# EasyEDA Pro project scribe.epro

# Schematic SmartPen
Board Name: SmartPen; Create Date: 2025-02-08; Page Name: Sheet_1; Project Name: SCRIBE; Schematic Name: SmartPen; Update Date: 2025-02-08; Add into BOM: yes; Company: Chmelnik industries; Convert to PCB: yes; Date: 2024-11-10; Draw By: AtemiS; REV: 1.0; Sheet: 1/1
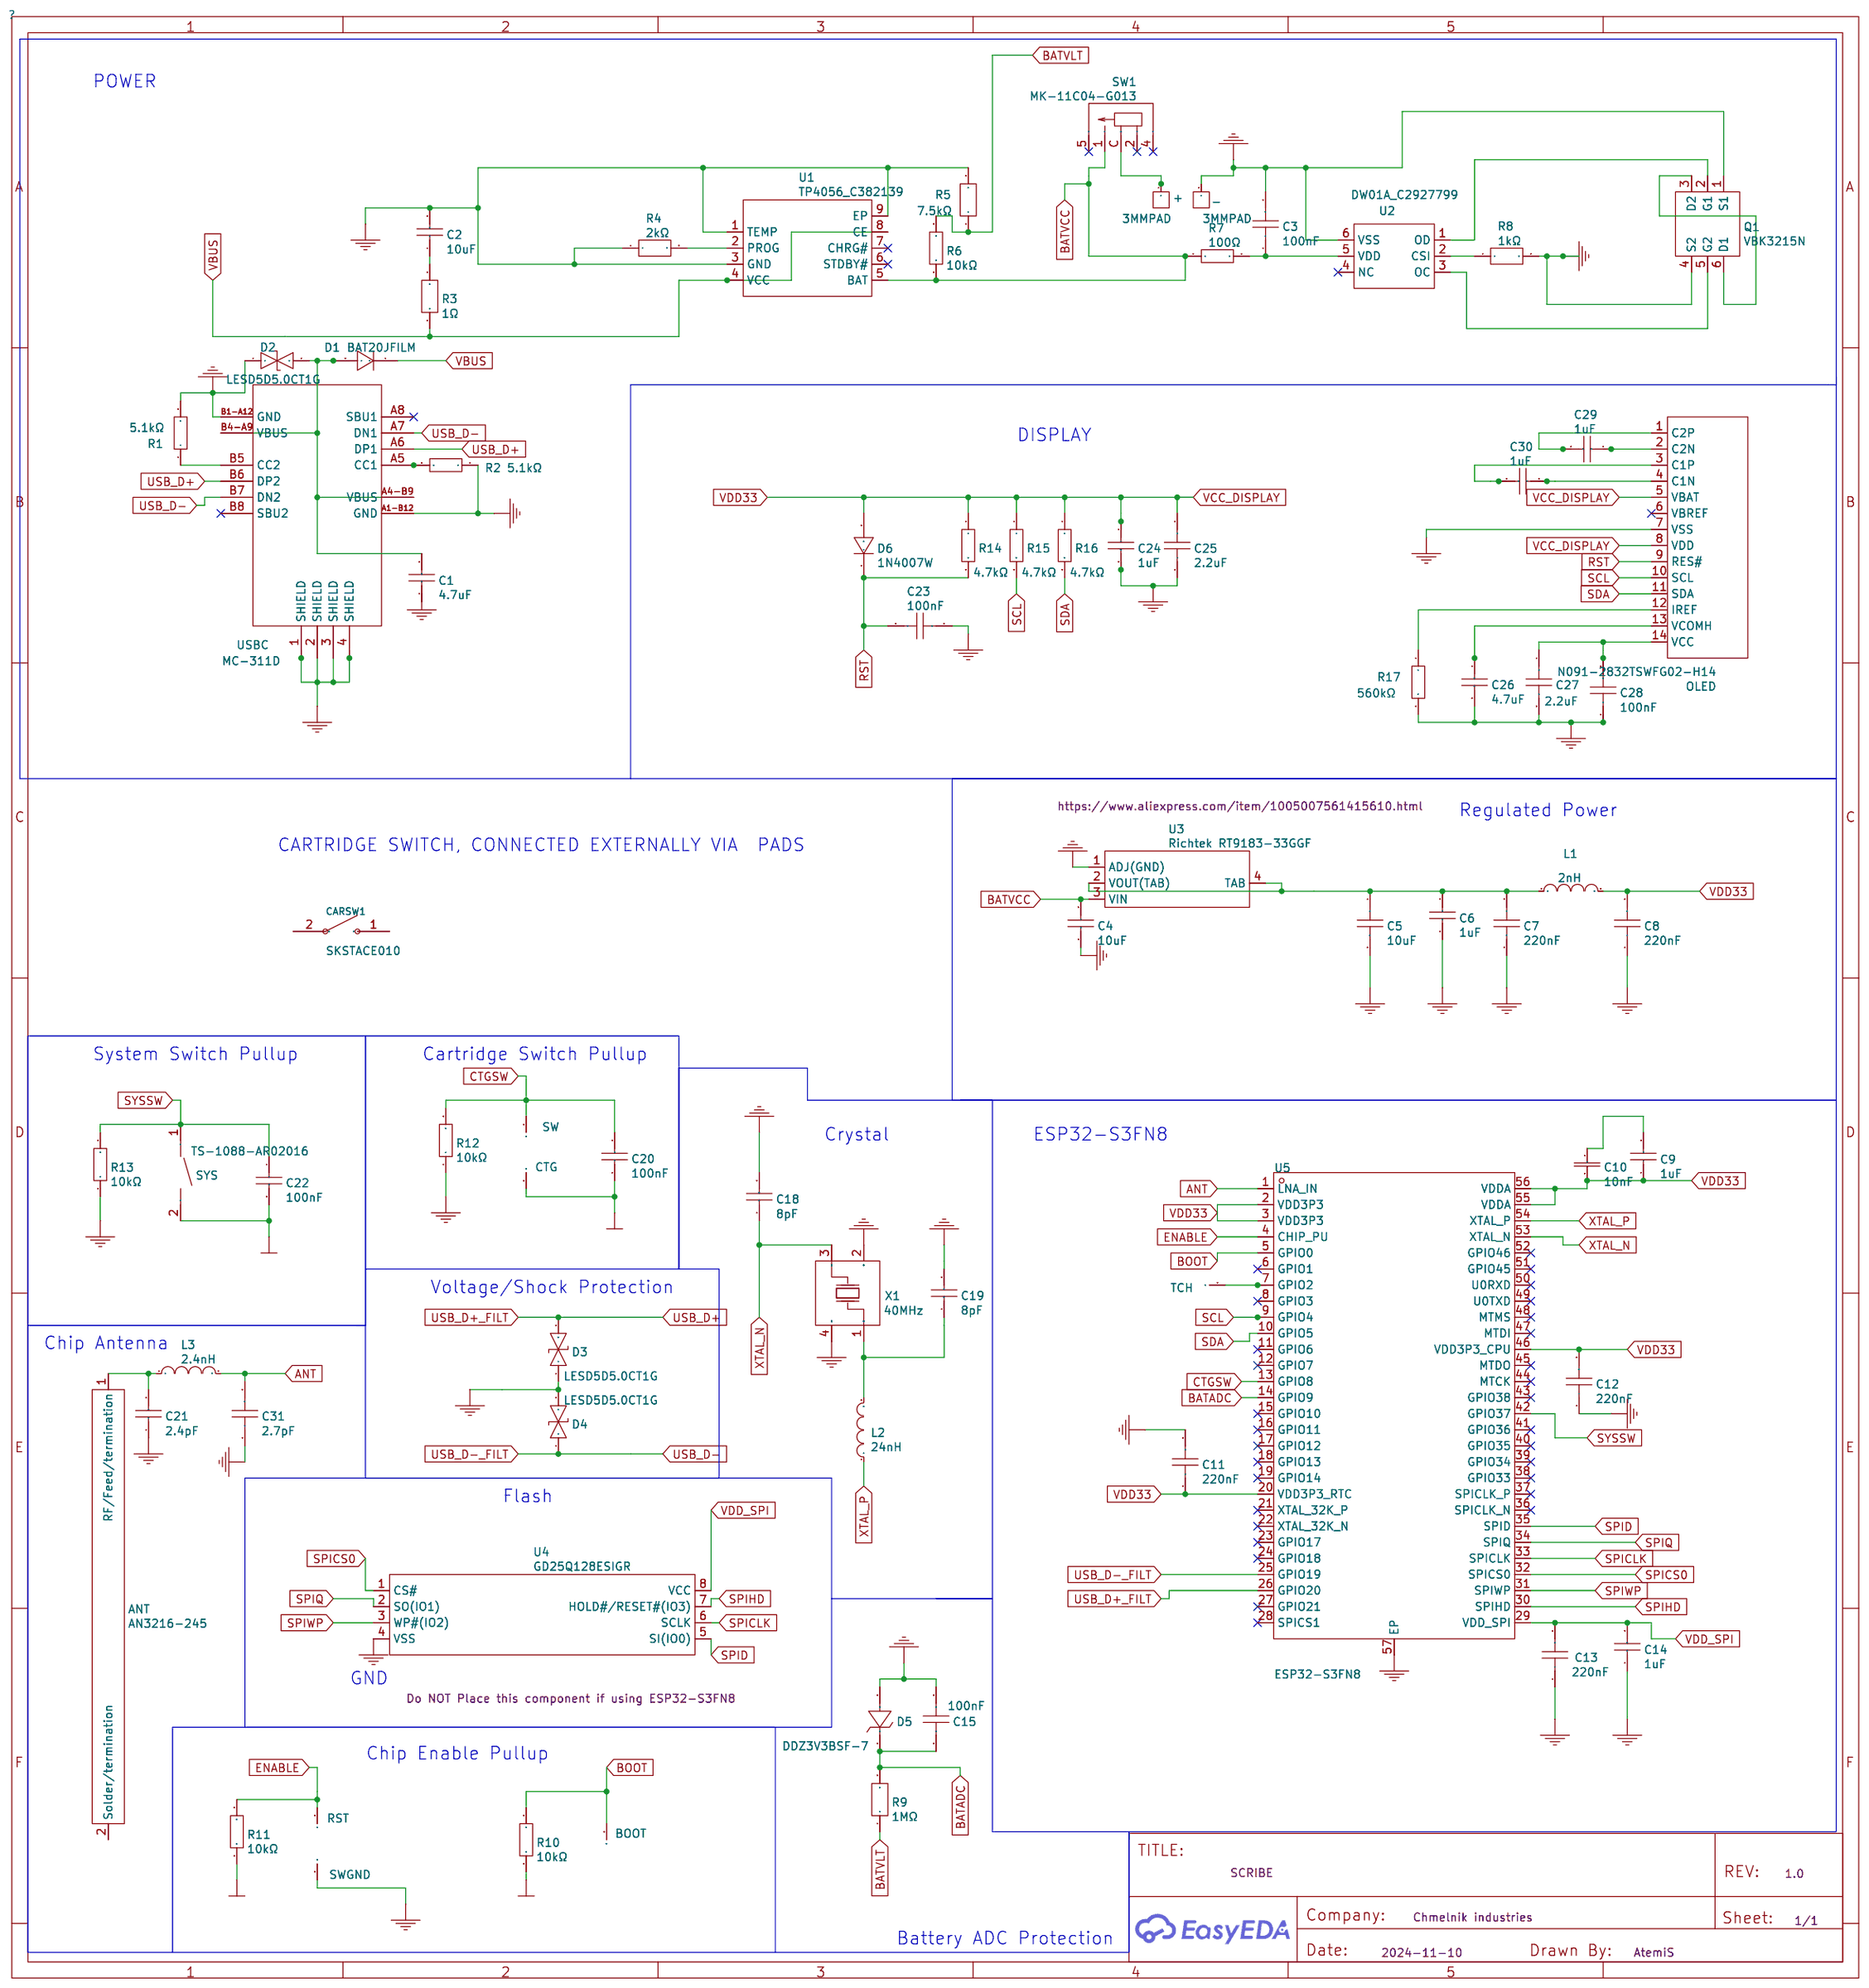
[diagram p0: schematic sheet]

## Parts
+  3MMPAD  [3MMPAD]  (no BOM)
_  3MMPAD  [3MMPAD]  (no BOM)
ANT  AN3216-245  [ANT-SMD_L3.2-W1.6-A]
BOOT  PAD_TERMINAL-32MIL_ROUND  [CON_PAD_ROUND_32MIL]  (no BOM)
C1  4.7uF  [C0805]
C2  10uF  [C0402]
C3  100nF  [C0603]
C4  10uF  [C0402]
C5  10uF  [C0603]
C6  1uF  [C0402]
C7  220nF  [C0402]
C8  220nF  [C0402]
C9  1uF  [C0402]
C10  10nF  [C0201]
C11  220nF  [C0402]
C12  220nF  [C0402]
C13  220nF  [C0402]
C14  1uF  [C0402]
C15  100nF  [C0603]
C18  8pF  [C0402]
C19  8pF  [C0402]
C20  100nF  [C0402]
C21  2.4pF  [C0402]
C22  100nF  [C0402]
C23  100nF  [C0603]
C24  1uF  [C0402]
C25  2.2uF  [C0603]
C26  4.7uF  [C0805]
C27  2.2uF  [C0603]
C28  100nF  [C0603]
C29  1uF  [C0402]
C30  1uF  [C0402]
C31  2.7pF  [C0402]
CARSW1  SKSTACE010  [SW-SMD_L8.5-W8.5-LS8.6]
CTG  PAD_TERMINAL-32MIL_ROUND  [CON_PAD_ROUND_32MIL]  (no BOM)
D1  BAT20JFILM  [SOD-323_L1.8-W1.3-LS2.5-RD]
D2  LESD5D5.0CT1G  [SOD-523_L1.2-W0.8-LS1.6-BI]
D3  LESD5D5.0CT1G  [SOD-523_L1.2-W0.8-LS1.6-BI]
D4  LESD5D5.0CT1G  [SOD-523_L1.2-W0.8-LS1.6-BI]
D5  DDZ3V3BSF-7  [SOD-323F_L1.7-W1.3-LS2.5-RD]
D6  1N4007W  [SOD-123_L2.8-W1.8-LS3.7-RD]
L1  2nH  [L0402-RD]
L2  24nH  [IND-SMD_L1.2-W0.6]
L3  2.4nH  [L0402]
OLED  N091-2832TSWFG02-H14  [OLED-SMD_N091-2832TSWFG02-H14]
Q1  VBK3215N  [SC-70-6_L2.2-W1.3-P0.65-LS2.1-BR]
R1  5.1kΩ  [R0603]
R2  5.1kΩ  [R0603]
R3  1Ω  [R1206]
R4  2kΩ  [RES-SMD_L3.5-W1.5]
R5  7.5kΩ  [R1206]
R6  10kΩ  [R1206]
R7  100Ω  [R1206]
R8  1kΩ  [R1206]
R9  1MΩ  [R0603]
R10  10kΩ  [R0603]
R11  10kΩ  [R0603]
R12  10kΩ  [R0603]
R13  10kΩ  [R0603]
R14  4.7kΩ  [R0603]
R15  4.7kΩ  [R0603]
R16  4.7kΩ  [R0603]
R17  560kΩ  [R1206]
RST  PAD_TERMINAL-32MIL_ROUND  [CON_PAD_ROUND_32MIL]  (no BOM)
SW  PAD_TERMINAL-32MIL_ROUND  [CON_PAD_ROUND_32MIL]  (no BOM)
SW1  MK-11C04-G013  [SW-SMD_MK-11C04-G013]
SWGND  PAD_TERMINAL-32MIL_ROUND  [CON_PAD_ROUND_32MIL]  (no BOM)
SYS  TS-1088-AR02016  [SW-SMD_L3.9-W3.0-P4.45]
TCH  PAD_TERMINAL-32MIL_ROUND  [CON_PAD_ROUND_32MIL]  (no BOM)
U1  TP4056_C382139  [ESOP-8_L4.9-W3.9-P1.27-LS6.0-BL-EP]
U2  DW01A_C2927799  [SOT-23-6_L2.9-W1.6-P0.95-LS2.8-BL]
U3  Richtek RT9183-33GGF  [SOT-223-4_L6.5-W3.5-P2.30-LS7.0-BR]
U4  GD25Q128ESIGR  [SOP-8_L5.3-W5.3-P1.27-LS8.0-BL]
U5  ESP32-S3FN8  [QFN-56_L7.0-W7.0-P0.40-TL-EP4.0]
USBC  MC-311D  [USB-C-SMD_MC-311D]
X1  40MHz  [CRYSTAL-SMD_4P-L2.5-W2.0-BL]

## Library data of the parts
+ _ = 3MMPAD
ANT = AN3216-245: Supplier: LCSC; Supplier Part: C2916136; Manufacturer: rainsun(霖昱微); JLCPCB Part Class: Extended Part
BOOT CTG RST SW SWGND TCH = PAD_TERMINAL-32MIL_ROUND
C1 C26 = 4.7uF: Supplier: LCSC; Manufacturer Part: CL21A475KAQNNNE; Manufacturer: SAMSUNG(三星); Supplier Part: C1779; JLCPCB Part Class: Basic Part
C2 C4 = 10uF: Supplier: LCSC; Manufacturer Part: CL05A106MQ5NUNC; Manufacturer: SAMSUNG(三星); Supplier Part: C15525; JLCPCB Part Class: Basic Part
C3 C15 C23 C28 = 100nF: Supplier: LCSC; Manufacturer: YAGEO(国巨); Manufacturer Part: CC0603KRX7R9BB104; Supplier Part: C14663; JLCPCB Part Class: Basic Part
C5 = 10uF: Supplier: LCSC; Manufacturer: SAMSUNG(三星); Manufacturer Part: CL10A106KP8NNNC; Supplier Part: C19702; JLCPCB Part Class: Basic Part
C6 C9 C14 C24 C29 C30 = 1uF: Supplier: LCSC; Manufacturer Part: GRM155R61C105KA12D; Manufacturer: muRata(村田); Supplier Part: C77006; JLCPCB Part Class: Extended Part
C7 C8 C11-C13 = 220nF: Supplier: LCSC; Supplier Part: C475248; Manufacturer: SANYEAR(叁叶源); Manufacturer Part: C0402X7R224K160NT; JLCPCB Part Class: Extended Part
C10 = 10nF: Supplier: LCSC; Supplier Part: C258479; Manufacturer: DARFON(达方); Manufacturer Part: C0603X5R103KDT; JLCPCB Part Class: Extended Part
C18 C19 = 8pF: Supplier: LCSC; Manufacturer: FH(风华); Manufacturer Part: 0402CG8R0C500NT; Supplier Part: C1578; JLCPCB Part Class: Extended Part
C20 C22 = 100nF: Supplier: LCSC; Manufacturer Part: CL05B104KO5NNNC; Manufacturer: SAMSUNG(三星); Supplier Part: C1525; JLCPCB Part Class: Basic Part
C21 = 2.4pF: Supplier: LCSC; Manufacturer: FH(风华); Manufacturer Part: 0402CG2R4C500NT; Supplier Part: C48346; JLCPCB Part Class: Extended Part
C25 C27 = 2.2uF: Supplier: LCSC; Supplier Part: C599715; Manufacturer: KEMET(基美); Manufacturer Part: C0603C225K8RAC7867; JLCPCB Part Class: Extended Part; link: https://lcsc.com/eda_search?q=C599715&amp;%26type=1&amp;ref=editor
C31 = 2.7pF: Supplier: LCSC; Supplier Part: C326937; Manufacturer: YAGEO(国巨); Manufacturer Part: CC0402BRNPO9BN2R7; JLCPCB Part Class: Extended Part
CARSW1 = SKSTACE010: Circuit:SPST Actuator Style:Round Button Mounting Style:Brick nogging Switch Length:8.5mm Switch Width:8.5mm Switch Height:3.95mm Contact Current:50mA Voltage Rating (DC):16V With Lamp:- Mechanical Life:-; LCSC Part Name: 8.5*8.5*3.95mm 立贴 轻触开关; Supplier Part: C341731; Manufacturer: ALPSALPINE(阿尔卑斯阿尔派); Supplier Footprint: SMD; JLCPCB Part Class: Extended Part; Datasheet: https://atta.szlcsc.com/upload/public/pdf/source/20181207/C341731_83631AC416A995A22756F96AE3924A85.pdf; Supplier: LCSC; Circuit: SPST; Actuator Style: Round Button; Mounting Style: Brick nogging; Switch Length: 8.5mm; Switch Width: 8.5mm; Switch Height: 3.95mm; Contact Current: 50mA; Voltage Rating (DC): 16V
D1 = BAT20JFILM: Supplier Part: C155590; Supplier: LCSC; Manufacturer: ST(意法半导体); JLCPCB Part Class: Extended Part
D2-D4 = LESD5D5.0CT1G: Supplier: LCSC; Supplier Part: C383211; Manufacturer: LRC(乐山无线电); JLCPCB Part Class: Extended Part
D5 = DDZ3V3BSF-7: Supplier: LCSC; Supplier Part: C156333; Manufacturer: DIODES(美台); JLCPCB Part Class: Extended Part
D6 = 1N4007W: Supplier: LCSC; Supplier Part: C328592; Manufacturer: BLUE ROCKET
L1 = 2nH: Supplier: LCSC; Supplier Part: C404617; Manufacturer: TDK; Manufacturer Part: MLG1005S2N0BTD25; JLCPCB Part Class: Extended Part
L2 = 24nH: Supplier: LCSC; Supplier Part: C370295; Manufacturer: Sunlord(顺络); Manufacturer Part: SDWL1005C24NJSTF; JLCPCB Part Class: Extended Part
L3 = 2.4nH: Supplier: LCSC; Manufacturer: muRata(村田); Manufacturer Part: LQG15HS2N4S02D; Supplier Part: C97997; JLCPCB Part Class: Extended Part; link: https://lcsc.com/eda_search?q=C97997&amp;%26type=1&amp;ref=editor
OLED = N091-2832TSWFG02-H14: Supplier: LCSC; Supplier Part: C2890599; Manufacturer: Newvision(新智景); JLCPCB Part Class: Extended Part
Q1 = VBK3215N: Supplier: LCSC; Supplier Part: C516947; Manufacturer: VBsemi(微碧半导体); JLCPCB Part Class: Extended Part
R1 R2 = 5.1kΩ: Supplier: LCSC; Manufacturer Part: 0603WAF5101T5E; Manufacturer: UNI-ROYAL(厚声); Supplier Part: C23186; JLCPCB Part Class: Basic Part
R3 = 1Ω: Supplier: LCSC; Supplier Part: C513714; Manufacturer: YAGEO(国巨); Manufacturer Part: RT1206BRD071RL; JLCPCB Part Class: Extended Part
R4 = 2kΩ: Supplier: LCSC; Supplier Part: C410713; Manufacturer: Tyohm(幸亚电阻); Manufacturer Part: RJM74P0204F2T2001; JLCPCB Part Class: Extended Part
R5 = 7.5kΩ: Supplier: LCSC; Supplier Part: C870892; Manufacturer: YAGEO(国巨); Manufacturer Part: RT1206BRD077K5L; JLCPCB Part Class: Extended Part
R6 = 10kΩ: Supplier: LCSC; Manufacturer: YAGEO(国巨); Manufacturer Part: RT1206BRD0710KL; Supplier Part: C136889; JLCPCB Part Class: Extended Part
R7 = 100Ω: Supplier: LCSC; Supplier Part: C728670; Manufacturer: YAGEO(国巨); Manufacturer Part: RT1206BRD07100RL; JLCPCB Part Class: Extended Part
R8 = 1kΩ: Supplier: LCSC; Supplier Part: C706405; Manufacturer: YAGEO(国巨); Manufacturer Part: RT1206BRD071KL; JLCPCB Part Class: Extended Part
R9 = 1MΩ: Supplier: LCSC; Supplier Part: C427290; Manufacturer: PANASONIC(松下); Manufacturer Part: ERJP03J105V; JLCPCB Part Class: Extended Part
R10-R13 = 10kΩ: Supplier: LCSC; Manufacturer: UNI-ROYAL(厚声); Manufacturer Part: 0603WAF1002T5E; Supplier Part: C25804; JLCPCB Part Class: Basic Part
R14-R16 = 4.7kΩ: Supplier: LCSC; Supplier Part: C309085; Manufacturer: Viking(光颉); Manufacturer Part: ARG03BTC4701; JLCPCB Part Class: Extended Part
R17 = 560kΩ: Supplier: LCSC; Manufacturer: YAGEO(国巨); Manufacturer Part: RC1206FR-07560KL; Supplier Part: C137254; JLCPCB Part Class: Extended Part; link: https://lcsc.com/eda_search?q=C137254&amp;%26type=1&amp;ref=editor
SW1 = MK-11C04-G013: Supplier: LCSC; Supplier Part: C778185; Manufacturer: G-Switch(品赞); JLCPCB Part Class: Extended Part
SYS = TS-1088-AR02016: Supplier: LCSC; Supplier Part: C720477; Manufacturer: XUNPU(讯普); JLCPCB Part Class: Extended Part
U1 = TP4056_C382139: Supplier: LCSC; Supplier Part: C382139; Manufacturer: TPOWER(天源); Manufacturer Part: TP4056; JLCPCB Part Class: Extended Part
U2 = DW01A_C2927799: Supplier: LCSC; Supplier Part: C2927799; Manufacturer: YONGYUTAI(永裕泰); Manufacturer Part: DW01A; JLCPCB Part Class: Extended Part
U3 = AMS1117-3.3_C347222: You need to source this yoursef. LCSC doesnt have it; Supplier: Aliexpress; Supplier Part: https://www.aliexpress.com/item/1005007561415610.html; Manufacturer: Richtek; Manufacturer Part: RT9183-33GGF; JLCPCB Part Class: Extended Part; Link: https://www.aliexpress.com/item/1005007561415610.html
U4 = GD25Q128ESIGR: Do NOT Place this component if using ESP32-S3FN8; Supplier: LCSC; Supplier Part: C2928891; Manufacturer: GigaDevice(兆易创新); JLCPCB Part Class: Extended Part
U5 = ESP32-S3FN8: Supplier Part: C2913196; Manufacturer: ESPRESSIF(乐鑫); Supplier Footprint: QFN-56-EP(7x7); JLCPCB Part Class: Extended Part; Datasheet: https://atta.szlcsc.com/upload/public/pdf/source/20241030/3428D9BCA56E860957850BFAF37EAC62.pdf; Supplier: LCSC
USBC = MC-311D: Supplier: LCSC; Supplier Part: C136423; Manufacturer: SOFNG(硕方); JLCPCB Part Class: Extended Part
X1 = 40MHz: Supplier: LCSC; Supplier Part: C409424; Manufacturer: KYX(凯越翔); Manufacturer Part: K2C400000910; JLCPCB Part Class: Extended Part

## Nets
GND: _.1 C1.1 C2.2 C3.2 C4.1 C5.2 C6.1 C7.1 C8.1 C11.2 C12.1 C13.1 C14.1 C15.2 C18.2 C19.2 C21.1 C23.1 C24.2 C25.2 C26.2 C27.2 C28.1 C31.1 D2.1 D3.1 D4.2 D5.2(A) OLED.7(VSS) Q1.1(S1) Q1.4(S2) R1.2 R2.1 R4.1 R5.2 R8.2 R12.1 R13.1 R17.2 SWGND.P U1.1(TEMP) U1.3(GND) U1.9(EP) U2.6(VSS) U3.1(ADJ(GND)) U4.4(VSS) U5.57(EP) USBC.1(SHIELD) USBC.2(SHIELD) USBC.3(SHIELD) USBC.4(SHIELD) USBC.A1-B12(GND) USBC.B1-A12(GND) X1.2(GND) X1.4(GND)
VBUS: D1.1(K) R3.2 U1.4(VCC) U1.8(CE)
VDD33: C8.2 C9.1 C10.2 C11.1 C12.2 C20.2 C22.2 C24.1 C25.1 CTG.P D6.2 L1.2 OLED.5(VBAT) OLED.8(VDD) R10.1 R11.1 R14.1 R15.1 R16.1 SYS.2 U5.2(VDD3P3) U5.3(VDD3P3) U5.20(VDD3P3_RTC) U5.46(VDD3P3_CPU) U5.55(VDDA) U5.56(VDDA)
VDD_SPI: C13.2 C14.2 U4.8(VCC) U5.29(VDD_SPI)
ANT: C31.2 L3.2 U5.1(LNA_IN)
BATADC: C15.1 D5.1(K) R9.2 U5.14(GPIO9)
BATVCC: C4.2 R6.1 R7.1 SW1.1 U1.5(BAT) U3.3(VIN)
BATVLT: R5.1 R6.2 R9.1
BOOT: BOOT.P R10.2 U5.5(GPIO0)
CTGSW: C20.1 R12.2 SW.P U5.13(GPIO8)
ENABLE: R11.2 RST.P U5.4(CHIP_PU)
RST: C23.2 D6.1 OLED.9(RES#) R14.2
SCL: OLED.10(SCL) R15.2 U5.9(GPIO4)
SDA: OLED.11(SDA) R16.2 U5.10(GPIO5)
SPICLK: U4.6(SCLK) U5.33(SPICLK)
SPICS0: U4.1(CS#) U5.32(SPICS0)
SPID: U4.5(SI(IO0)) U5.35(SPID)
SPIHD: U4.7(HOLD#/RESET#(IO3)) U5.30(SPIHD)
SPIQ: U4.2(SO(IO1)) U5.34(SPIQ)
SPIWP: U4.3(WP#(IO2)) U5.31(SPIWP)
SYSSW: C22.1 R13.2 SYS.1 U5.42(GPIO37)
USB_D+: D3.2 U5.26(GPIO20) USBC.A6(DP1) USBC.B6(DP2)
USB_D-: D4.1 U5.25(GPIO19) USBC.A7(DN1) USBC.B7(DN2)
XTAL_N: C18.1 U5.53(XTAL_N) X1.3(OSC2)
XTAL_P: L2.1 U5.54(XTAL_P)
ANT_1: ANT.1(RF/Feed/termination) C21.2 L3.1
C1_2: C1.2 D1.2(A) D2.2 USBC.A4-B9(VBUS) USBC.B4-A9(VBUS)
C9_2: C9.2 C10.1
L2_2: C19.1 L2.2 X1.1(OSC1)
Net-(TCH-P): TCH.P U5.7(GPIO2)
OLED_1: C29.2 OLED.1(C2P)
OLED_2: C29.1 OLED.2(C2N)
OLED_3: C30.2 OLED.3(C1P)
OLED_4: C30.1 OLED.4(C1N)
OLED_12: OLED.12(IREF) R17.1
OLED_13: C26.1 OLED.13(VCOMH)
OLED_14: C27.1 C28.2 OLED.14(VCC)
Q1_6: Q1.3(D2) Q1.6(D1)
R3_1: C2.1 R3.1
SW1_C: +.1 SW1.C
U1_2: R4.2 U1.2(PROG)
U2_1: Q1.2(G1) U2.1(OD)
U2_2: R8.1 U2.2(CSI)
U2_3: Q1.5(G2) U2.3(OC)
U2_5: C3.1 R7.2 U2.5(VDD)
U3_2: C5.1 C6.2 C7.2 L1.1 U3.2(VOUT(TAB)) U3.4(TAB)
USBC_A5: R2.2 USBC.A5(CC1)
USBC_B5: R1.1 USBC.B5(CC2)

Not connected (* = marked no-connect by the designer): ANT 2(Solder/termination); CARSW1 1 2; OLED 6(VBREF)*; SW1 2* 4* 5*; U1 6(STDBY#)* 7(CHRG#)*; U2 4(NC)*; U5 6(GPIO1)* 8(GPIO3)* 11(GPIO6)* 12(GPIO7)* 15(GPIO10)* 16(GPIO11)* 17(GPIO12)* 18(GPIO13)* 19(GPIO14)* 21(XTAL_32K_P)* 22(XTAL_32K_N)* 23(GPIO17)* 24(GPIO18)* 27(GPIO21)* 28(SPICS1)* 36(SPICLK_N)* 37(SPICLK_P)* 38(GPIO33)* 39(GPIO34)* 40(GPIO35)* 41(GPIO36)* 43(GPIO38)* 44(MTCK)* 45(MTDO)* 47(MTDI)* 48(MTMS)* 49(U0TXD)* 50(U0RXD)* 51(GPIO45)* 52(GPIO46)*; USBC A8(SBU1)* B8(SBU2)*

## Notes on the sheet
- POWER
- DISPLAY
- Regulated Power
- CARTRIDGE SWITCH, CONNECTED EXTERNALLY VIA  PADS
- System Switch Pullup
- Cartridge Switch Pullup
- Crystal
- ESP32-S3FN8
- Voltage/Shock Protection
- Chip Antenna
- Flash
- GND
- Chip Enable Pullup
- Battery ADC Protection

# Board PCB_PCB_SmartPen_3_2024-12-07
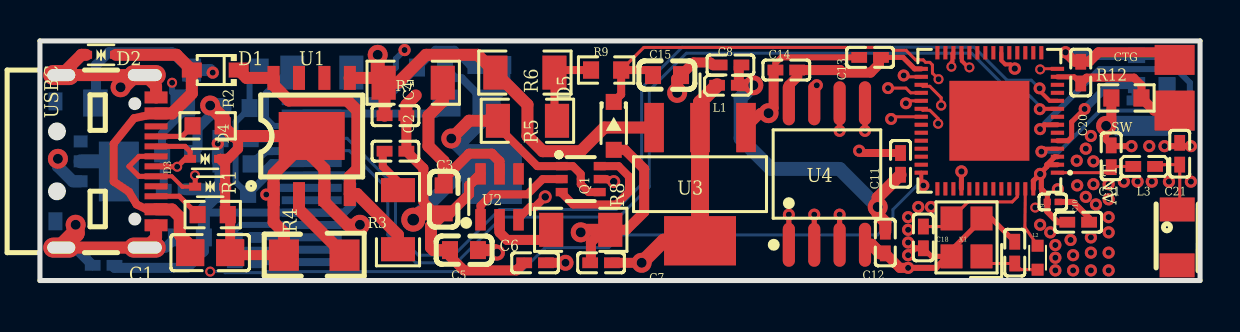
[diagram p1: board, top side]
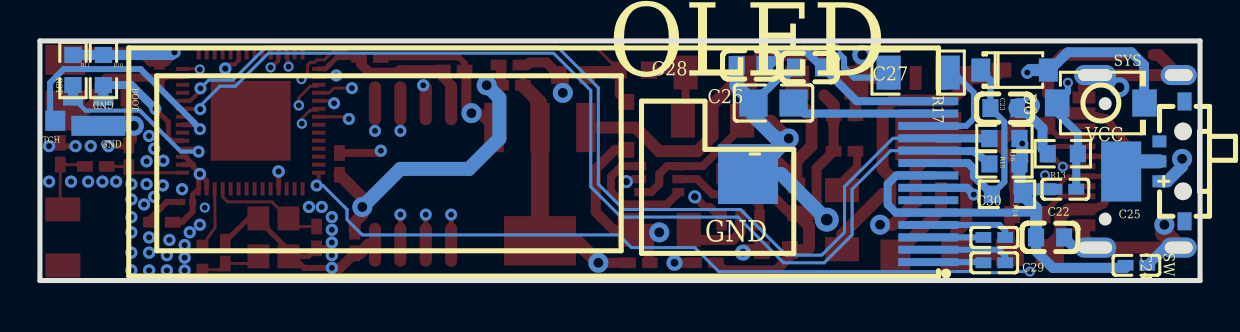
[diagram p2: board, bottom side, seen from below]

Outline 58.05 x 12 mm; copper layers: Top Layer, Inner1, Inner2, Bottom Layer. Coordinates in mm from the lower left corner of the outline.
Outline path: 0,12 58.05,12 58.05,0 0,0 0,12
Stack: Top Layer 0.035mm / Dielectric1 0.48mm PP er 4.5 / Inner1 0.035mm / Dielectric2 0.48mm FR4 er 4.5 / Inner2 0.035mm / Dielectric3 0.48mm PP er 4.5 / Bottom Layer 0.035mm

## Design rules (mm)
template: User Custom Config
spacing Default (default): track to track 0.152, other pairs 0 to 0.4
track width Default: min 0.254, default 0.254, max 25.4
track width ESP (default): min 0.15, default 0.15, max 25.4
track width VBUS: min 1.999, default 1.999, max 25.4
differential pair differentialPair (default): width min 0.127, default 0.254, max 2.54; gap min 0.152, default 0.152
via Default: diameter min 0.61, default 0.61, max 100.025; hole min 0.305, default 0.305, max 59.995
via ESP (default): diameter min 0.399, default 0.399, max 100.025; hole min 0.201, default 0.201, max 59.995
via VBUS: diameter min 0.8, default 0.8, max 100.025; hole min 0.399, default 0.399, max 59.995
net GND uses ESP, copperRegion1
net SPIWP uses ESP
net SPIQ uses ESP
net SPICS0 uses ESP
net SPID uses ESP
net SPICLK uses ESP
net SPIHD uses ESP
net ENABLE uses ESP
net BOOT uses ESP
net SCL uses ESP
net SDA uses ESP
net SYSSW uses ESP
net BATADC uses ESP
net XTAL_P uses ESP
net ANT uses ESP
net XTAL_N uses ESP
net RST uses ESP
net ESP_7 uses ESP
net USB_D-_FILT uses ESP
net USB_D+_FILT uses ESP
net L2_2 uses ESP
net OLED_12 uses ESP
net OLED_2 uses ESP
net OLED_3 uses ESP
net OLED_4 uses ESP
net OLED_13 uses ESP
net OLED_14 uses ESP
net OLED_1 uses ESP
net ANT_1 uses ESP
net ANT_2 uses ESP
pour e1468 uses Default

## Placement (name value [footprint] x y rotation side)
+  -  [3MMPAD#2]  3.95 5.46 270 bottom
_  -  [3MMPAD]  22.61 5.33 180 bottom
ANT  AN3216-245  [ANT-SMD_L3.2-W1.6-A]  56.9 2.16 270 top
BOOT  PAD_TERMINAL-32MIL_ROUND  [CON_PAD_ROUND_32MIL#3]  54.87 9.02 180 bottom
C1  4.7uF  [C0805]  8.52 1.4 180 top
C2  10uF  [C0402]  17.79 6.48 0 top
C3  100nF  [C0603]  20.2 4.06 270 top
C4  10uF  [C0402]  17.79 8.25 180 top
C5  10uF  [C0603]  21.22 1.52 180 top
C6  1uF  [C0402]  24.77 0.89 0 top
C7  220nF  [C0402]  28.08 0.89 0 top
C8  220nF  [C0402]  34.55 10.79 0 top
C9  1uF  [C0402]  51.95 2.92 0 top
C10  10nF  [C0201]  50.68 3.94 180 top
C11  220nF  [C0402]  43.06 5.84 90 top
C12  220nF  [C0402]  42.3 1.9 90 top
C13  220nF  [C0402]  41.54 11.18 0 top
C14  1uF  [C0402]  37.35 10.54 0 top
C15  100nF  [C0603]  31.38 10.29 0 top
C18  8pF  [C0402]  44.2 2.16 270 top
C19  8pF  [C0402]  48.78 1.4 90 top
C20  100nF  [C0402]  52.08 10.41 90 top
C21  2.4pF  [C0402]  57.03 6.35 270 top
C22  100nF  [C0402]  6.74 4.57 0 bottom
C23  100nF  [C0603]  9.79 8.64 0 bottom
C24  1uF  [C0402]  3.18 0.76 180 bottom
C25  2.2uF  [C0603]  7.5 2.16 180 bottom
C26  4.7uF  [C0805]  21.34 8.89 0 bottom
C27  2.2uF  [C0603]  19.57 10.67 0 bottom
C28  100nF  [C0603]  22.49 10.79 180 bottom
C29  1uF  [C0402]  10.3 0.89 0 bottom
C30  1uF  [C0402]  10.3 2.16 0 bottom
C31  2.7pF  [C0402]  53.6 6.22 270 top
CTG  PAD_TERMINAL-32MIL_ROUND  [CON_PAD_ROUND_32MIL#2]  56.78 11.05 0 top
D1  BAT20JFILM  [SOD-323_L1.8-W1.3-LS2.5-RD]  8.77 10.54 180 top
D2  LESD5D5.0CT1G  [SOD-523_L1.2-W0.8-LS1.6-BI]  3.06 11.3 0 top
D3  LESD5D5.0CT1G  [SOD-523_L1.2-W0.8-LS1.6-BI]  8.52 4.7 180 top
D4  LESD5D5.0CT1G  [SOD-523_L1.2-W0.8-LS1.6-BI]  8.26 6.1 0 top
D5  DDZ3V3BSF-7  [SOD-323F_L1.7-W1.3-LS2.5-RD]  28.71 7.75 270 top
D6  1N4007W  [SOD-123_L2.8-W1.8-LS3.7-RD]  9.28 10.54 180 bottom
ESP  ESP32-S3  [QFN-56_L7.0-W7.0-P0.40-TL-EP4.0]  47.51 8 180 top
L1  2nH  [L0402-RD]  34.42 9.78 0 top
L2  24nH  [IND-SMD_L1.2-W0.6]  49.92 1.14 270 top
L3  2.4nH  [L0402]  55.25 5.71 180 top
NOREF  -  [Pad_e169]  55.13 7.75 90 top
OLED  N091-2832TSWFG02-H14  [OLED-SMD_N091-2832TSWFG02-H14]  13.6 4.95 180 bottom
Q1  VBK3215N  [SC-70-6_L2.2-W1.3-P0.65-LS2.1-BR]  27.06 5.08 180 top
R1  5.1kΩ  [R0603]  8.64 3.3 0 top
R2  5.1kΩ  [R0603]  8.39 7.75 180 top
R3  1Ω  [R1206]  17.92 3.05 270 top
R4  2kΩ  [RES-SMD_L3.5-W1.5]  13.72 1.27 0 top
R5  7.5kΩ  [R1206]  24.39 8 180 top
R6  10kΩ  [R1206]  24.27 10.41 0 top
R7  100Ω  [R1206]  18.68 9.91 0 top
R8  1kΩ  [R1206]  27.06 2.54 0 top
R9  1MΩ  [R0603]  28.33 10.54 0 top
R10  10kΩ  [R0603]  54.87 10.54 270 bottom
R11  10kΩ  [R0603]  56.4 10.54 270 bottom
R12  10kΩ  [R0603]  54.36 9.14 0 top
R13  10kΩ  [R0603]  6.87 6.35 180 bottom
R14  4.7kΩ  [R0603]  9.66 4.32 0 bottom
R15  4.7kΩ  [R0603]  9.79 5.84 0 bottom
R16  4.7kΩ  [R0603]  9.79 7.11 0 bottom
R17  560kΩ  [R1206]  14.11 10.41 0 bottom
RST  PAD_TERMINAL-32MIL_ROUND  [CON_PAD_ROUND_32MIL#3]  56.4 9.02 180 bottom
SW  PAD_TERMINAL-32MIL_ROUND  [CON_PAD_ROUND_32MIL]  56.78 8.51 0 top
SW1  MK-11C04-G013  [SW-SMD_MK-11C04-G013]  1.41 5.97 90 bottom
SYS  TS-1088-AR02016  [SW-SMD_L3.9-W3.0-P4.45]  4.96 8.89 180 bottom
TCH  PAD_TERMINAL-32MIL_ROUND  [CON_PAD_ROUND_32MIL#4]  57.29 8 180 bottom
U1  TP4056_C382139  [ESOP-8_L4.9-W3.9-P1.27-LS6.0-BL-EP]  13.6 7.24 0 top
U2  DW01A_C2927799  [SOT-23-6_L2.9-W1.6-P0.95-LS2.8-BL]  23 4.19 0 top
U3  Richtek RT9183-33GGF  [SOT-223-4_L6.5-W3.5-P2.30-LS7.0-BR]  33.03 4.83 90 top
U4  GD25Q128ESIGR  [SOP-8_L5.3-W5.3-P1.27-LS8.0-BL]  39.38 5.33 0 top
USBC  MC-311D  [USB-C-SMD_MC-311D]  3.44 5.97 270 top
X1  40MHz  [CRYSTAL-SMD_4P-L2.5-W2.0-BL]  46.36 2.16 90 top

## Footprints (pads in the part's own frame, mm; a bottom-side part is the same pattern mirrored in y, then rotated)
3MMPAD
  rect 3x3 smd: 1(0.001,-0.001)
3MMPAD#2
  rect 3x2 smd: 1(0.001,-0.001)
ANT-SMD_L3.2-W1.6-A
  rect 1.2x1.75 smd: 1(-1.4,0.004) 2(1.4,-0.004)
C0201
  rect 0.368x0.324 smd: 1(-0.275,0) 2(0.275,0)
C0402
  rect 0.79x0.54 smd: 1(-0.545,0) 2(0.545,0)
C0603
  rect 0.8x0.9 smd: 1(-0.7,0) 2(0.7,0)
C0805
  rect 1.41x1.35 smd: 1(-1,0) 2(1,0)
CON_PAD_ROUND_32MIL
  rect 2x2 smd: P(0,0)
CON_PAD_ROUND_32MIL#2
  rect 2x1.5 smd: P(0,0)
CON_PAD_ROUND_32MIL#3
  rect 1x0.5 smd: P(0,0)
CON_PAD_ROUND_32MIL#4
  rect 1x1 smd: P(0,0)
CRYSTAL-SMD_4P-L2.5-W2.0-BL
  rect 1.2x1.1 smd: 1(-0.95,-0.75) 2(0.95,-0.75) 3(0.95,0.75) 4(-0.95,0.75)
ESOP-8_L4.9-W3.9-P1.27-LS6.0-BL-EP
  rect 0.6x1.2 smd: 1(-1.905,-2.909) 2(-0.635,-2.909) 3(0.635,-2.909) 4(1.905,-2.909) 5(1.905,2.909) 6(0.635,2.909) 7(-0.635,2.909) 8(-1.905,2.909)
  rect 3.3x2.4 smd: 9(0,0)
IND-SMD_L1.2-W0.6
  rect 0.6x0.6 smd: 1(-0.6,0) 2(0.6,0)
L0402
  rect 0.79x0.54 smd: 1(-0.545,0) 2(0.545,0)
L0402-RD
  rect 0.79x0.54 smd: 1(-0.545,0) 2(0.545,0)
OLED-SMD_N091-2832TSWFG02-H14
  rect 3x0.4 smd: 1(0,-4.03) 2(0,-3.41) 3(0,-2.79) 4(0,-2.17) 5(0,-1.55) 6(0,-0.93) 7(0,-0.31) 8(0,0.31) 9(0,0.93) 10(0,1.55) 11(0,2.17) 12(0,2.79) 13(0,3.41) 14(0,4.03)
Pad_e169
  rect 1x2.7 smd far side: 1(0,0)
QFN-56_L7.0-W7.0-P0.40-TL-EP4.0
  rect 0.665x0.2 smd: 1(-3.408,2.6) 2(-3.408,2.2) 3(-3.408,1.8) 4(-3.408,1.401) 5(-3.408,1) 6(-3.408,0.6) 7(-3.408,0.2) 8(-3.408,-0.2) 9(-3.408,-0.6) 10(-3.408,-1) 11(-3.408,-1.4) 12(-3.408,-1.8) 13(-3.408,-2.2) 14(-3.408,-2.599) 29(3.408,-2.599) 30(3.408,-2.2) 31(3.408,-1.8) 32(3.408,-1.4) 33(3.408,-1) 34(3.408,-0.6) 35(3.408,-0.2) 36(3.408,0.2) 37(3.408,0.6) 38(3.408,1) 39(3.408,1.401) 40(3.408,1.8) 41(3.408,2.2) 42(3.408,2.6)
  rect 0.2x0.665 smd: 15(-2.6,-3.408) 16(-2.2,-3.408) 17(-1.8,-3.408) 18(-1.4,-3.408) 19(-1,-3.408) 20(-0.6,-3.408) 21(-0.2,-3.408) 22(0.2,-3.408) 23(0.6,-3.408) 24(1,-3.408) 25(1.4,-3.408) 26(1.8,-3.408) 27(2.2,-3.408) 28(2.6,-3.408) 43(2.6,3.408) 44(2.2,3.408) 45(1.8,3.408) 46(1.4,3.408) 47(1,3.408) 48(0.6,3.408) 49(0.2,3.408) 50(-0.2,3.408) 51(-0.6,3.408) 52(-1,3.408) 53(-1.4,3.408) 54(-1.8,3.408) 55(-2.2,3.408) 56(-2.6,3.408)
  rect 4x4 smd: 57(0,0.001)
R0603
  rect 0.806x0.864 smd: 1(-0.753,0) 2(0.753,0)
R1206
  rect 1.208x1.701 smd: 1(-1.479,0) 2(1.479,0)
RES-SMD_L3.5-W1.5
  rect 1.5x1.566 smd: 1(-1.518,0) 2(1.518,0)
SC-70-6_L2.2-W1.3-P0.65-LS2.1-BR
  rect 0.6x0.42 smd: 1(0.95,-0.65) 2(0.95,0) 3(0.95,0.65) 4(-0.95,0.65) 5(-0.95,0) 6(-0.95,-0.65)
SOD-123_L2.8-W1.8-LS3.7-RD
  rect 0.95x1.15 smd: 1(-1.692,0) 2(1.692,0)
SOD-323_L1.8-W1.3-LS2.5-RD
  rect 1x0.75 smd: 1(-1.173,0) 2(1.173,0)
SOD-323F_L1.7-W1.3-LS2.5-RD
  rect 0.8x0.8 smd: 1(-1.2,0) 2(1.2,0)
SOD-523_L1.2-W0.8-LS1.6-BI
  rect 0.6x0.4 smd: 1(-0.75,0) 2(0.75,0)
SOP-8_L5.3-W5.3-P1.27-LS8.0-BL
  oval 0.609x2.204 smd: 1(-1.905,-3.542) 2(-0.635,-3.542) 3(0.635,-3.542) 4(1.905,-3.542) 5(1.905,3.542) 6(0.635,3.542) 7(-0.635,3.542) 8(-1.905,3.542)
SOT-23-6_L2.9-W1.6-P0.95-LS2.8-BL
  rect 0.532x1.072 smd: 1(-0.95,-1.149) 2(0,-1.149) 3(0.95,-1.149) 4(0.95,1.149) 5(0,1.149) 6(-0.95,1.149)
SOT-223-4_L6.5-W3.5-P2.30-LS7.0-BR
  rect 2.47x0.98 smd: 1(2.835,-2.3) 2(2.835,0) 3(2.835,2.3)
  rect 2.47x3.6 smd: 4(-2.835,0)
SW-SMD_L3.9-W3.0-P4.45
  rect 1.23x1.36 smd: 1(-2.185,0) 2(2.185,0)
SW-SMD_MK-11C04-G013
  rect 0.6x0.7 smd: 1(-1,0.63) 2(1,0.63) C(0,0.63)
  rect 0.9x0.7 smd: 4(3,-0.63) 5(-3,-0.63)
USB-C-SMD_MC-311D
  oval 1x2.1 hole 0.6x1.7: 1(-4.32,1.808) 4(4.32,1.808)
  oval 1x1.8 hole 0.6x1.4: 2(-4.32,-2.373) 3(4.32,-2.373)
  rect 0.6x1.15 smd: A1-B12(-3.2,2.373) A4-B9(-2.4,2.373) B1-A12(3.2,2.373) B4-A9(2.4,2.373)
  rect 0.3x1.15 smd: A5(-1.25,2.373) A6(-0.25,2.373) A7(0.25,2.373) A8(1.25,2.373) B5(1.75,2.373) B6(0.75,2.373) B7(-0.75,2.373) B8(-1.75,2.373)

## Nets
GND: _.1 C1.1 C2.2 C3.2 C4.1 C5.2 C6.1 C7.1 C8.1 C11.2 C12.1 C13.1 C14.1 C15.2 C18.2 C19.2 C21.1 C23.1 C24.2 C25.2 C26.2 C27.2 C28.1 C31.1 D2.1 D3.1 D4.2 D5.2 ESP.57 NOREF.1 OLED.7 Q1.1 Q1.4 R1.2 R2.1 R4.1 R5.2 R8.2 R12.1 R13.1 R17.2 U1.1 U1.3 U1.9 U2.6 U3.1 U4.4 USBC.1 USBC.2 USBC.3 USBC.4 USBC.A1-B12 USBC.B1-A12 X1.2 X1.4
VBUS: D1.1 R3.2 U1.4 U1.8
VDD33: C8.2 C9.1 C10.2 C11.1 C12.2 C20.2 C22.2 C24.1 C25.1 CTG.P D6.2 ESP.2 ESP.3 ESP.20 ESP.46 ESP.55 ESP.56 L1.2 OLED.5 OLED.8 R10.1 R11.1 R14.1 R15.1 R16.1 SYS.2
VDD_SPI: C13.2 C14.2 ESP.29 U4.8
ANT: C31.2 ESP.1 L3.2
ANT_1: ANT.1 C21.2 L3.1
ANT_2: ANT.2
BATADC: C15.1 D5.1 ESP.14 R9.2
BATVCC: C4.2 R6.1 R7.1 SW1.1 U1.5 U3.3
BATVLT: R5.1 R6.2 R9.1
BOOT: BOOT.P ESP.5 R10.2
C1_2: C1.2 D1.2 D2.2 USBC.A4-B9 USBC.B4-A9
C9_2: C9.2 C10.1
CTGSW: C20.1 ESP.13 R12.2 SW.P
ENABLE: ESP.4 R11.2 RST.P
ESP_7: ESP.7 TCH.P
L2_2: C19.1 L2.2 X1.1
OLED_1: C29.2 OLED.1
OLED_2: C29.1 OLED.2
OLED_3: C30.2 OLED.3
OLED_4: C30.1 OLED.4
OLED_12: OLED.12 R17.1
OLED_13: C26.1 OLED.13
OLED_14: C27.1 C28.2 OLED.14
Q1_6: Q1.3 Q1.6
R3_1: C2.1 R3.1
RST: C23.2 D6.1 OLED.9 R14.2
SCL: ESP.9 OLED.10 R15.2
SDA: ESP.10 OLED.11 R16.2
SPICLK: ESP.33 U4.6
SPICS0: ESP.32 U4.1
SPID: ESP.35 U4.5
SPIHD: ESP.30 U4.7
SPIQ: ESP.34 U4.2
SPIWP: ESP.31 U4.3
SW1_C: +.1 SW1.C
SYSSW: C22.1 ESP.42 R13.2 SYS.1
U1_2: R4.2 U1.2
U2_1: Q1.2 U2.1
U2_2: R8.1 U2.2
U2_3: Q1.5 U2.3
U2_5: C3.1 R7.2 U2.5
U3_2: C5.1 C6.2 C7.2 L1.1 U3.2 U3.4
USB_D+_FILT: D3.2 ESP.26 USBC.A6 USBC.B6
USB_D-_FILT: D4.1 ESP.25 USBC.A7 USBC.B7
USBC_A5: R2.2 USBC.A5
USBC_B5: R1.1 USBC.B5
XTAL_N: C18.1 ESP.53 X1.3
XTAL_P: ESP.54 L2.1

Pads without a net: ESP 6 8 11 12 15 16 17 18 19 21 22 23 24 27 28 36 37 38 39 40 41 43 44 45 47 48 49 50 51 52; OLED 6; SW1 2 4 5; U1 6 7; U2 4; USBC A8 B8

## Via types
v1: diameter 0.61, hole 0.305, Top Layer to Bottom Layer, 47 vias
v2: diameter 1, hole 0.5, Top Layer to Bottom Layer, 14 vias
v3: diameter 0.6, hole 0.3, Top Layer to Bottom Layer, 16 vias
v4: diameter 0.5, hole 0.3, Top Layer to Bottom Layer, 9 vias
v5: diameter 1.2, hole 0.6, Top Layer to Bottom Layer, 1 via
v6: diameter 0.52, hole 0.3, Top Layer to Bottom Layer, 1 via
v7: diameter 0.51, hole 0.3, Top Layer to Bottom Layer, 1 via
v8: diameter 0.62, hole 0.32, Top Layer to Bottom Layer, 4 vias
v9: diameter 0.8, hole 0.4, Top Layer to Bottom Layer, 2 vias
v10: diameter 0.65, hole 0.38, Top Layer to Bottom Layer, 2 vias

## Routing (per net, layer and track width the routed paths; a pad name or vN(x,y) marks a point on that pad's centre or on a via; arc(x,y) is an arc through that point)
GND: length 144.4
  Top Layer w0.254: C19.2 47.61,3.11 47.11,3.11 47.11,3.04 45.61,1.54 X1.4 44.61,1.21 C18.2
  Top Layer w0.3: X1.4 45.41,1.21 44.84,0.63 v1(43.44,0.63) ; 36.8,10.54 36.8,10.88 37.09,11.18 C13.1 ; v1(54.62,6.73) 53.64,6.73 C31.1 53.35,7.02 v2(53.35,7.75) ; C18.2 43.79,1.61 v1(43.44,1.27) ; v1(57.59,6.73) 57.2,6.73 C21.1 56.87,6.73 v1(56.27,6.73)
  Top Layer w0.4: v1(40.99,6.5) 41.11,6.39 C11.2 ; 22.91,8 22.91,7.7 24.89,5.73 Q1.1 26.66,5.73 27.06,5.33 27.06,4.83 27.46,4.43 Q1.4
  Top Layer w0.5: v1(43.44,0.63) 43.02,0.63 C12.1 ; U3.1 36.05,8.38 v2(36.46,8.38) 36.71,8.64 36.71,10.54 C14.1 ; R8.2 28.2,2.54 27.57,1.9 27.57,0.93 C7.1 ; 18.33,6.48 19.19,5.62 19.19,3.94 19.76,3.36 ; 20.52,1.52 20.52,1.21 21.22,0.51 23.85,0.51 24.23,0.89 ; R4.1 9.52,1.27 9.52,3.18 R1.2 9.27,3.43 D3.1 9.27,5.84 D4.2 9.41,6.1 9.91,6.6 9.91,6.97 R2.1 ; 28.71,6.55 29.27,6.55 30.23,5.59 30.23,3.43 29.35,2.54 28.54,2.54 ; C4.1 C2.2 ; R12.1 53.61,7.75 53.35,7.75 ; C15.2 32.71,10.92 33.54,10.92 33.66,10.79 C8.1 ; C3.2 20.52,3.36 21.47,4.32 21.47,4.77 U2.6
  Top Layer w0.6: USBC.1 5.81,9.72 USBC.A1-B12 ; USBC.3 USBC.4 5.3,1.65 5.81,2.16 USBC.B1-A12 ; v2(31.89,9.4) 31.89,10.09 C15.2 ; 4.65,10.29 USBC.2 2.08,11.3 D2.1 ; U1.9 13.6,6.22 14.23,5.59 U1.3 ; U1.9 9.65,7.24 R2.1 ; U1.9 11.69,5.33 U1.1 11.69,2.92 12.21,2.41 R4.1 ; v2(16.01,2.79) 15.38,2.79 14.23,3.94 14.23,4.33 ; R8.2 27.19,2.54 v2(27.06,2.41) ; U4.4 41.61,1.79 42.05,1.36 C12.1 ; 18.33,7.89 C4.1 18.33,8.8 18.8,9.27 ; R5.2 21.47,8 v2(20.58,7.11) ; 20.52,1.52 19.69,1.52 19.57,1.65 19.57,2.73 C3.2
  Top Layer w0.7: R2.1 9.14,8.14 v2(8.52,8.76) ; C3.2 18.99,3.36 v5(18.68,3.05)
  Top Layer w0.9: v2(4.03,9.68) 4.65,10.29 USBC.1 ; USBC.3 1.79,2.37 v2(1.79,2.79)
  Bottom Layer w0.3: 15.35,10.67 15.35,10.64 R17.2 15.84,10.16 17.3,10.16 17.81,10.67 17.81,11.11 v1(18.24,11.54)
  Bottom Layer w0.4: v3(11.32,4.31) 11.66,4.64 13.22,4.64 ; C27.2 20.8,10.14 21.1,10.14 C26.2
  Bottom Layer w0.5: C24.2 1.75,1.65 USBC.3 ; C25.2 6.29,1.65 USBC.4 ; R13.1 7.88,6.61 7.88,7.62 8.52,8.25 v2(8.52,8.76) ; v2(53.35,7.75) 55.25,7.75
  Bottom Layer w0.7: 22.36,5.33 v2(20.58,7.11) 21.22,7.11 22.34,8.24 C26.2 23.19,9.73 C28.1 ; 22.36,5.33 _.1 ; 22.36,5.33 20.96,5.33 v5(18.68,3.05)
  Bottom Layer w1: v2(8.52,8.76) 8.64,8.64 C23.1
  vias: v1(43.44,3.17) v1(43.44,2.54) v1(43.44,1.9) v1(43.95,3.68) v1(44.58,3.68) v1(50.05,2.79) v1(50.55,2.41) v1(50.81,1.78) v1(50.81,1.14) v1(50.81,0.51) v1(50.94,4.57) v1(51.57,2.03) v1(51.7,1.27) v1(51.7,0.51) v1(51.88,6) v1(51.9,4.77) v1(52.33,6.6) v1(52.33,4.19) v1(52.59,7.24) v1(52.59,2.16) v1(52.59,1.4) v1(52.59,0.51) v1(52.71,5.97) v1(52.71,4.83) v1(52.84,3.81) v1(53.48,4.83) v1(53.48,4.06) v1(53.48,3.17) v1(53.48,2.41) v1(53.48,1.4) v1(53.48,0.51) v1(54.24,4.95) v1(54.92,4.95) v1(55.51,6.73) v1(55.63,4.95) v1(56.49,4.95) v1(57.59,4.95) v4(49.8,3.65)
VBUS: length 15.3
  Top Layer w0.6: U1.8 10.34,10.15 D1.1 ; 17.92,1.57 17.92,2.29 15.87,4.33 15.5,4.33 15.5,5.21 15.88,5.59 15.88,8.51 15.38,9.02 12.45,9.02 11.69,9.78 11.69,10.15
VDD33: length 135.8
  Top Layer w0.2: v8(48.78,10.61) 48.57,10.82 48.3,10.82 48.11,11.02 ESP.20
  Top Layer w0.254: 50.39,5.8 50.79,6.2 50.91,6.2 ; 50.39,5.8 ESP.2 ; 50.39,5.8 50.39,5.7 50.05,5.36 v8(50.05,5.33) ; 46.11,5.46 46.11,4.59 ; C10.2 50.41,4.29 50.15,4.55 arc(50.14,4.58) ESP.56 50.11,5.27 v8(50.05,5.33) ; ESP.55 49.71,4.99 v8(50.05,5.33)
  Top Layer w0.3: 50.41,3.94 50.41,3.45 50.94,2.92 51.41,2.92
  Top Layer w0.5: v8(51.32,11.43) 51.79,10.96 C20.2 52.5,10.96 52.97,11.43 57.03,11.43 57.29,11.18 ; 34.97,9.78 34.97,10.67 C8.2
  Top Layer w0.6: 34.97,9.78 v2(35.7,9.78) ; C11.1 41.92,4.15 v2(41.92,3.68) 41.92,3.3 42.3,2.92 42.3,2.45
  Inner2 w0.5: v2(41.92,3.68) 43.7,5.46 46.11,5.46 ; 50.43,11.43 51.57,10.16 51.57,6.73 50.17,5.33 v8(50.05,5.33) 46.24,5.33 v8(46.11,5.46) ; 50.43,11.43 49.59,11.43 v8(48.78,10.61) ; 50.43,11.43 v8(51.32,11.43)
  Inner2 w0.6: 8.64,10.41 8.14,10.41 4.58,6.86 4.58,4.44 7.76,1.27 19.44,1.27 25.41,7.24 33.16,7.24 v2(35.7,9.78)
  Inner2 w0.7: 8.64,10.41 10.04,9.02 10.04,8 v1(8.9,6.86)
  Bottom Layer w0.4: 13.22,3.4 8.2,3.4 ; 13.22,5.26 15.19,5.26 15.63,4.83 15.63,3.81 15.22,3.4 13.22,3.4
  Bottom Layer w0.5: v8(51.32,11.43) 51.45,11.29 R10.1 R11.1 ; C24.1 3.73,0.63 7.37,0.63 8.2,1.46 C25.1 ; D6.2 7.5,10.54 6.61,11.43 3.44,11.43 2.8,10.8 2.8,8.92 2.78,8.89
  Bottom Layer w0.6: D6.2 8.52,10.54 v1(8.64,10.41) ; C25.1 8.2,3.61 R14.1 ; C22.2 8.65,4.57 R14.1 ; v1(8.9,6.86) 8.9,5.98 R15.1 9.03,4.44 R14.1
  Bottom Layer w0.7: v2(41.92,3.68) 40.01,5.59 36.58,5.59 35.06,7.11 35.06,9.14 v2(35.7,9.78)
VDD_SPI: length 8.9
  Top Layer w0.254: 42.08,11.18 43.19,11.18 43.76,10.6 ESP.29
  Top Layer w0.5: C14.2 37.89,10.2 37.47,9.78 U4.8 ; 41.98,11.18 41.98,10.83 41.56,10.41 40.17,10.41 40.04,10.54 37.79,10.54
ANT: length 4.2
  Top Layer w0.15: L3.2 54.02,5.72 C31.2 53.71,5.4 50.91,5.4
ANT_1: length 3.5
  Top Layer w0.15: 57.03,3.56 C21.2 56.27,5.8 55.8,5.72
BATADC: length 26.9
  Top Layer w0.15: v4(44.96,10.08) 44.66,10.39 44.66,10.79 44.52,10.93 44.32,10.93 44.2,11.05 43.82,11.05 43.33,11.53 42.71,11.53 42.57,11.67 30.21,11.67 R9.2 ; v4(50.05,10.57) 50.08,10.61 50.91,10.61
  Top Layer w0.4: 30.68,10.29 30.42,10.54 R9.2 29.08,9.32 D5.1
  Inner2 w0.15: v4(50.05,10.57) 49.56,10.08 49,10.08 49,10.08 48.55,10.08 48.55,10.08 v4(44.96,10.08)
BATVCC: length 45.1
  Top Layer w0.6: 16.96,10.15 U1.5 ; C4.2 17.24,9.86 R7.1 17.92,9.91 19.31,11.3 21.9,11.3 22.79,10.41 24.39,8.81 24.39,7.24 25.15,6.48 27.06,6.48 28.24,7.66 U3.3
  Top Layer w0.7: v2(16.9,11.3) 16.9,10.2 16.96,10.15 R7.1
  Inner2 w0.254: v2(0.9,6.1) 2.04,4.95
  Inner2 w0.6: v2(0.9,6.1) 2.68,7.87 2.68,10.16 3.82,11.3 v2(16.9,11.3)
  Bottom Layer w0.6: v2(0.9,6.1) 0.9,5.71 1.64,4.97 SW1.1
BATVLT: length 4.3
  Top Layer w0.4: R9.1 25.87,10.54 R6.2 25.74,8.13 R5.1
BOOT: length 6.3
  Top Layer w0.254: v3(52.27,8.59) 51.62,7.94 51.62,7.18 51.44,7 ESP.5
  Bottom Layer w0.4: v3(52.27,8.59) 53.47,9.79 R10.2
  Bottom Layer w0.5: BOOT.P R10.2
C1_2: length 18.3
  Top Layer w0.4: USBC.B4-A9 5.33,3.57 4.83,3.81 4.45,4.44 3.69,4.95 3.69,6.86 4.71,8.13 USBC.A4-B9
  Top Layer w0.6: D2.2 6.84,11.3 D1.2 7.6,9.37 6.6,8.37 USBC.A4-B9 ; USBC.B4-A9 6.61,3.56 6.99,3.17 6.99,2.29 7.52,1.76 7.52,1.27
C9_2: length 2.1
  Top Layer w0.3: 52.5,2.92 52.5,3.14 51.7,3.94 50.96,3.94
CTGSW: length 7.6
  Top Layer w0.254: C20.1 51.75,10.2 50.91,10.2
  Top Layer w0.4: C20.1 52.37,10.16 54.75,10.16 55.12,9.79 R12.2
  Top Layer w0.5: R12.2 55.75,8.51 57.16,8.51
ENABLE: length 9
  Top Layer w0.2: v3(50.11,6.45) 50.26,6.6 ESP.4
  Bottom Layer w0.2: v3(50.11,6.45) 50.99,6.45 53.05,8.51 55.76,8.51 56.27,9.02 56.4,9.02
  Bottom Layer w0.5: RST.P R11.2
ESP_7: length 12
  Top Layer w0.25: ESP.7 50.26,7.8 v3(50.04,7.58)
  Bottom Layer w0.3: TCH.P 57.54,8.25 57.54,9.91 56.86,10.59 53.01,10.59 50.3,7.87 50.3,7.84 v3(50.04,7.58)
L2_2: length 3.1
  Top Layer w0.15: L2.2 49.08,0.54 C19.1 47.47,0.85 X1.1
OLED_1: length 2.4
  Bottom Layer w0.3: 13.22,0.92 10.87,0.92 10.84,0.89
OLED_2: length 3.9
  Bottom Layer w0.3: C29.1 9.75,1.23 10.06,1.54 13.22,1.54
OLED_3: length 2.4
  Bottom Layer w0.3: 13.22,2.16 10.84,2.16 10.84,2.16
OLED_4: length 3.9
  Bottom Layer w0.3: 13.22,2.78 10.03,2.78 9.75,2.5 C30.1
OLED_12: length 5.1
  Bottom Layer w0.3: R17.1 12.33,10.41 11.31,9.4 11.31,8.13 11.7,7.74 13.22,7.74
OLED_13: length 7.3
  Bottom Layer w0.4: C26.1 19.82,8.36 13.22,8.36
OLED_14: length 10
  Bottom Layer w0.4: 13.22,8.98 17.18,8.98 C27.1 18.99,10.79 19.02,10.79 19.79,11.56 20.75,11.56 21.51,10.79 C28.2
Q1_6: length 6.4
  Top Layer w0.4: Q1.6 28.95,5.73 29.47,5.21 29.47,4.44 28.84,3.81 26.68,3.81 26.11,4.38 Q1.3
R3_1: length 2.3
  Top Layer w0.4: C2.1 17.15,6.39 17.15,5.71 17.92,4.95 R3.1
RST: length 10.6
  Bottom Layer w0.3: R14.2 9.79,4.94 9.79,7.94 C23.2 10.49,10.06 D6.1
  Bottom Layer w0.4: 13.22,5.88 11.61,5.88 11.31,5.59 11.31,5.22 R14.2
SCL: length 52.7
  Top Layer w0.2: ESP.9 50.05,8.6 v3(50.03,8.58)
  Bottom Layer w0.15: 13.22,6.5 15.48,6.5 17.41,4.57 17.41,2.29 18.8,0.89 20.84,0.89 23.12,3.17 28.96,3.17 30.49,4.7 30.49,9.52 32.34,11.38 46.62,11.38 48.27,9.73 49.04,9.73 50.03,8.74 v3(50.03,8.58)
  Bottom Layer w0.4: 10.54,5.84 11.31,6.48 13.22,6.5
SDA: length 52.5
  Top Layer w0.2: ESP.10 50.52,9 50.02,9.51 v3(50.02,9.62)
  Bottom Layer w0.15: v3(50.02,9.62) 49.61,10.03 48.39,10.03 46.74,11.68 32.14,11.68 30.11,9.65 30.11,4.83 28.84,3.56 23,3.56 20.71,1.27 18.93,1.27 17.79,2.41 17.79,4.7 15.36,7.12 13.22,7.12
  Bottom Layer w0.4: 10.54,7.11 13.22,7.12
SPICLK: length 6.1
  Top Layer w0.15: v3(43.33,8.88) 43.46,9 ESP.33
  Top Layer w0.254: v3(40.01,7.49) U4.6
  Inner2 w0.254: v3(43.33,8.88) 41.4,8.88 v3(40.01,7.49)
SPICS0: length 12.7
  Top Layer w0.15: v3(42.44,9.64) 43.33,9.64 43.57,9.4 44.1,9.4
  Top Layer w0.254: v3(37.47,3.3) U4.1
  Inner2 w0.254: v3(37.47,3.3) 37.47,6.48 40.39,9.4 41.66,9.4 41.9,9.64 v3(42.44,9.64)
SPID: length 4.5
  Top Layer w0.15: 44.1,8.2 42.7,8.2 v3(42.59,8.09)
  Top Layer w0.254: v3(41.28,7.49) U4.5
  Inner2 w0.254: v3(41.28,7.49) 41.99,7.49 v3(42.59,8.09)
SPIHD: length 6.5
  Top Layer w0.15: v3(43.22,10.27) 43.29,10.2 44.1,10.2
  Top Layer w0.254: 38.64,8.88 38.87,9.1 v1(38.87,9.78)
  Inner2 w0.254: v3(43.22,10.27) 39.36,10.27 v1(38.87,9.78)
SPIQ: length 10.9
  Top Layer w0.15: v7(44.94,7.86) 44.94,8.11 44.52,8.53 44.17,8.53 ESP.34
  Top Layer w0.254: v3(38.74,3.3) U4.2
  Inner2 w0.254: v7(44.94,7.86) 43.3,7.86 v3(38.74,3.3)
SPIWP: length 13.2
  Top Layer w0.15: v6(45.09,8.77) 45.09,9.16 44.52,9.73 44.17,9.73 ESP.31
  Top Layer w0.254: v3(40.01,3.3) U4.3
  Inner2 w0.254: v6(45.09,8.77) 45.82,8.04 45.82,7.21 44.84,6.22 43.36,6.22 41.14,4 41.14,3.24 40.79,2.89 40.43,2.89 v3(40.01,3.3)
SW1_C: length 2.1
  Bottom Layer w0.7: SW1.C 3.44,5.97 +.1
SYSSW: length 60.3
  Top Layer w0.2: v3(44.2,4.76) 44.1,4.86 44.1,5.4
  Inner2 w0.15: v4(8.52,0.45) 4.64,0.45 2.68,2.41 2.68,5.97 6.61,9.91
  Bottom Layer w0.15: v4(8.52,0.45) 9.2,0.45 9.26,0.39 11.33,0.39 11.39,0.45 24.08,0.45 25.28,1.65 28.46,1.65 29.09,2.29 41.92,2.29 42.68,3.05 42.68,3.56 43.88,4.76 v3(44.2,4.76)
  Bottom Layer w0.3: v4(6.61,9.91) 6.61,9.42 SYS.1
  Bottom Layer w0.4: 7.15,8.89 7.15,8.41 6.1,7.37 6.11,6.35 ; R13.2 6.19,6.27 C22.1
U1_2: length 4
  Top Layer w0.6: R4.2 12.96,3.55 U1.2
U2_1: length 5.3
  Top Layer w0.4: U2.1 22.05,3.75 22.61,4.32 24.39,4.32 25.15,5.08 Q1.2
U2_2: length 3.6
  Top Layer w0.5: 23,3.04 23,2.41 23.38,2.03 25.07,2.03 25.58,2.54
U2_3: length 6.3
  Top Layer w0.4: v10(25.28,4.19) 24.77,3.68 24.52,3.68 23.95,3.11 U2.3 ; Q1.5 28.33,5.08 v10(28.71,4.95)
  Inner2 w0.4: v10(25.28,4.19) 26.04,4.95 v10(28.71,4.95)
U2_5: length 10.2
  Top Layer w0.5: C3.1 20.2,5.08 21.47,6.35 22.61,6.35 23,5.97 U2.5
  Top Layer w0.6: C3.1 20.2,5.97 19.44,6.73 19.44,8.25 20.16,8.97 20.16,9.91
U3_2: length 22.4
  Top Layer w0.5: v9(26.3,0.89) C6.2 ; v2(30.11,0.89) C7.2
  Top Layer w0.6: v9(22.87,1.4) 22.74,1.52 C5.1
  Top Layer w0.7: L1.1 33.03,8.93 U3.2 ; v2(30.11,0.89) 31.21,1.99 U3.4
  Top Layer w0.9: U3.2 U3.4
  Inner2 w0.8: v9(22.87,1.4) 23.38,0.89 v9(26.3,0.89) v2(30.11,0.89)
USB_D+_FILT: length 47
  Top Layer w0.2: D3.2 7.12,4.7 6.6,5.22 USBC.B6 ; ESP.26 45.66,11.36 45.66,10.97 45.61,10.92 v4(45.61,10.71)
  Top Layer w0.25: v4(7.76,5.27) 7.77,5.26 D3.2
  Top Layer w0.254: USBC.B6 4.95,5.22 4.45,5.71 4.96,6.22 USBC.A6
  Inner2 w0.25: v4(45.61,10.71) 45.27,11.05 19.31,11.05 13.54,5.27 v4(7.76,5.27)
USB_D-_FILT: length 47.4
  Top Layer w0.2: ESP.25 46.13,11.39 46.13,11 46.45,10.67 v4(46.51,10.67)
  Top Layer w0.254: USBC.B7 7.26,6.72 7.51,6.46 D4.1 7.26,6.1 v4(6.87,5.7) 6.45,5.7 6.43,5.72 USBC.A7
  Inner2 w0.25: v4(6.87,5.7) 7,5.83 13.48,5.85 19.19,11.56 45.51,11.56 46.39,10.67 v4(46.51,10.67)
USBC_A5: length 2
  Top Layer w0.254: R2.2 7.11,7.22 USBC.A5
USBC_B5: length 2.5
  Top Layer w0.254: R1.1 6.97,4.22 USBC.B5
XTAL_N: length 5.7
  Top Layer w0.15: C18.1 45.21,2.7 46.44,3.94 48.65,3.94 48.91,4.19 ESP.53
XTAL_P: length 3
  Top Layer w0.15: L2.1 49.28,2.67 49.31,4.59

## Copper pours and planes (outline as drawn; the poured copper is in the pictures)
GND on Inner1: 0,12 58.05,12 58.05,6.43 53.78,6.43 53.73,6.48 53.73,0 0,0
GND on Inner1: 0,12 58.05,12 58.05,4.71 53.74,4.71 53.73,4.7 53.73,0 0,0

## Text on the board
Bottom Silkscreen Layer: GND | VCC
